# Altium schematic sheet front-end.SchDoc
size A2
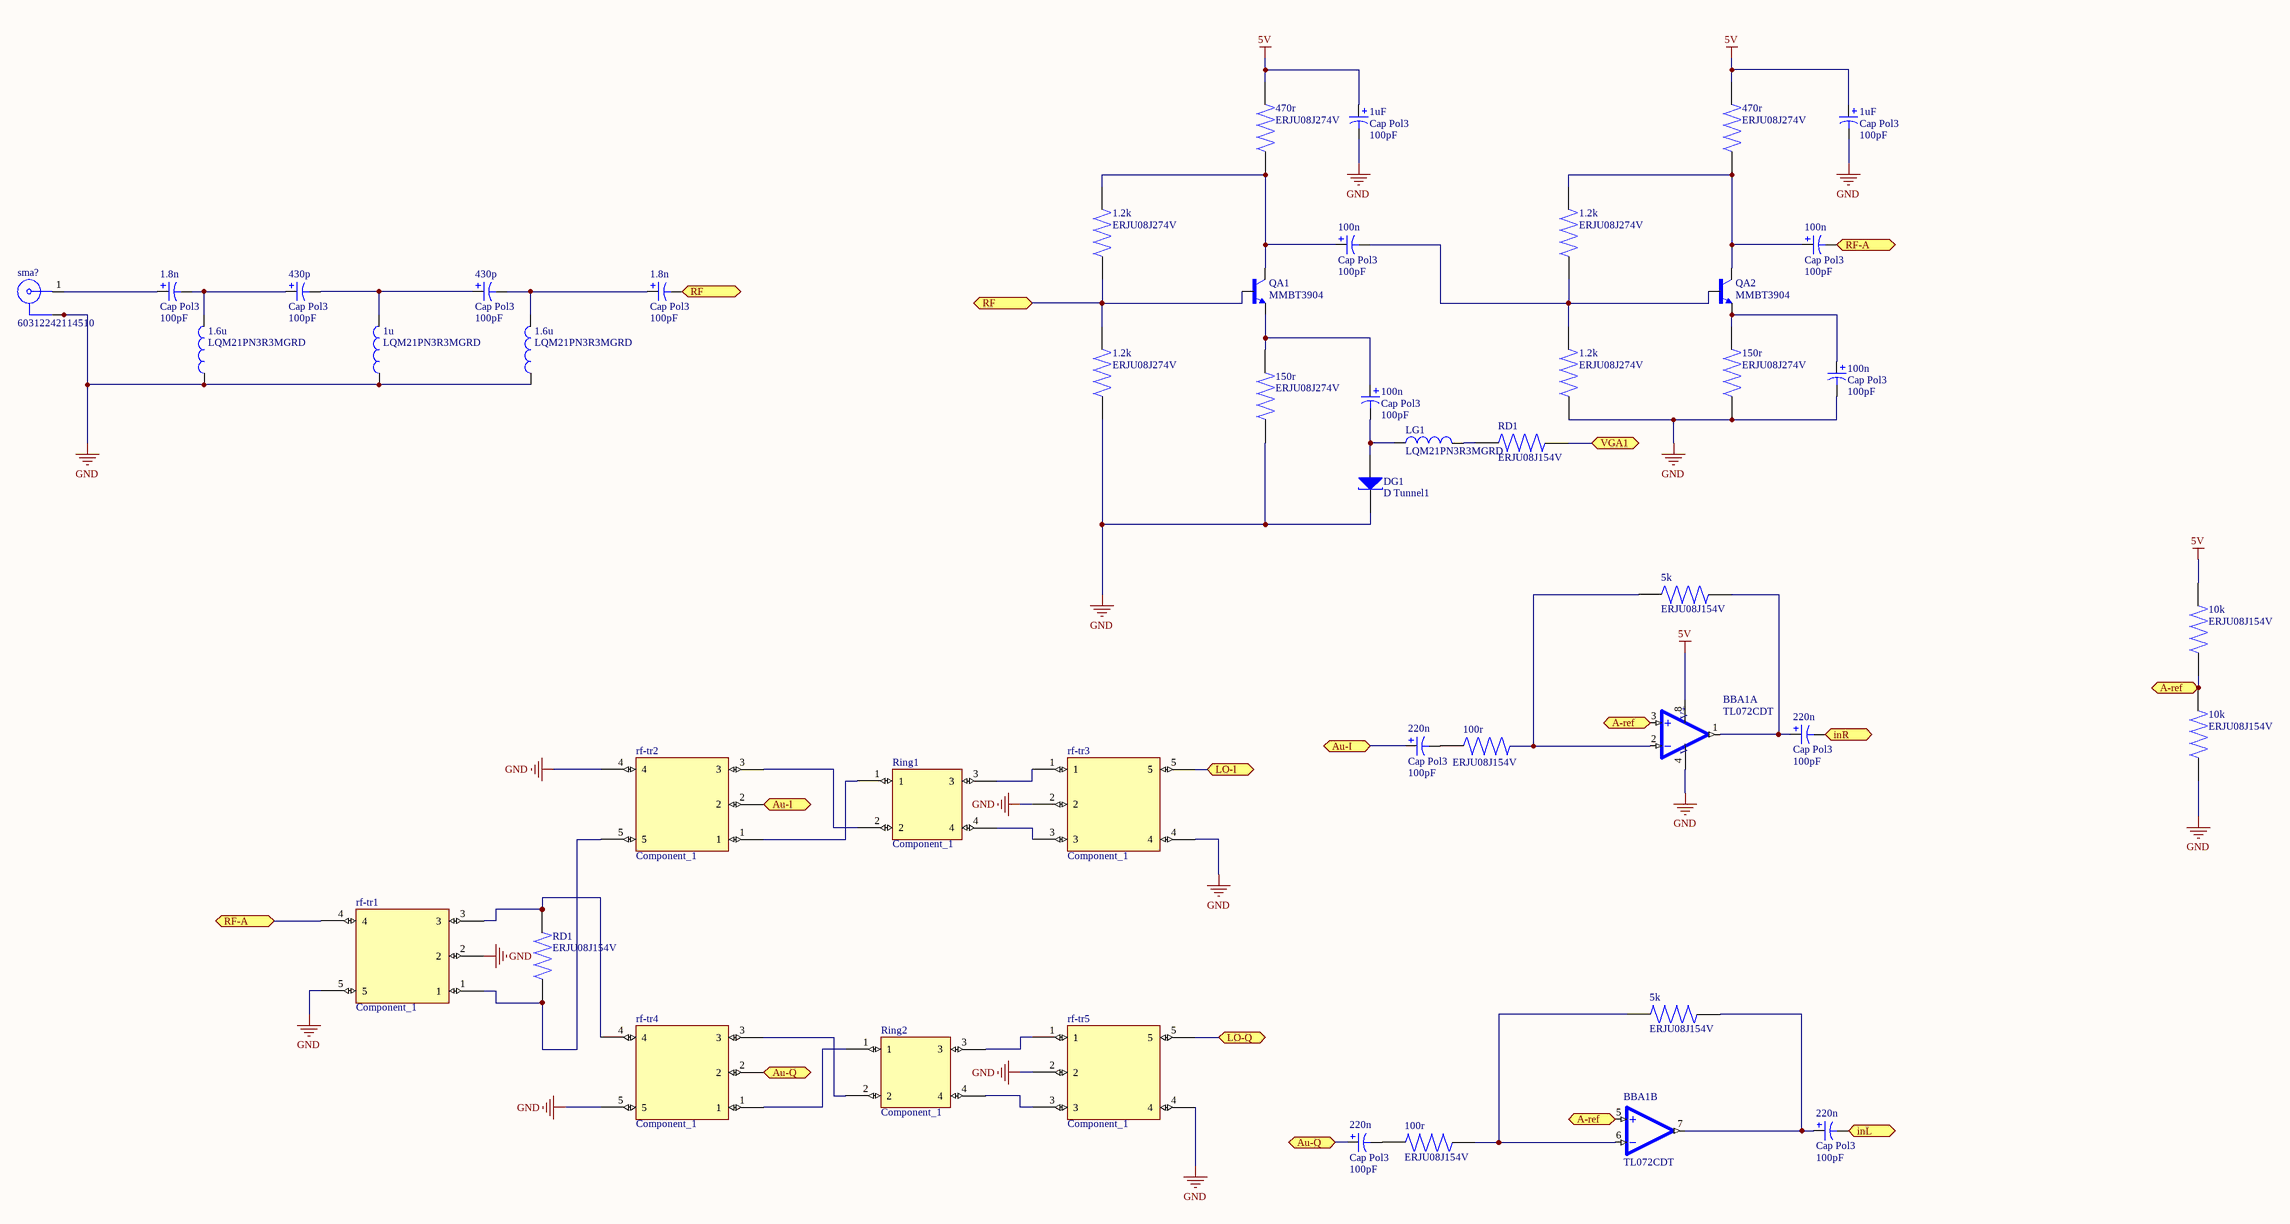
[diagram p0: front-end.SchDoc]

## Parts
(Parts that share a designator on the sheet are numbered #1, #2 ... from top to bottom, then left to right.)
1.2k#1  ERJU08J274V  [RES_ERJU08J274V]
1.2k#2  ERJU08J274V  [RES_ERJU08J274V]
1.2k#3  ERJU08J274V  [RES_ERJU08J274V]
1.2k#4  ERJU08J274V  [RES_ERJU08J274V]
1.6u#1  LQM21PN3R3MGRD  [INDC2012X100N]
1.6u#2  LQM21PN3R3MGRD  [INDC2012X100N]
1.8n#1  Cap Pol3  value 100pF  [C0805]
1.8n#2  Cap Pol3  value 100pF  [C0805]
1u  LQM21PN3R3MGRD  [INDC2012X100N]
1uF#1  Cap Pol3  value 100pF  [C0805]
1uF#2  Cap Pol3  value 100pF  [C0805]
5k#1  ERJU08J154V  [RES_ERJU08J154V]
5k#2  ERJU08J154V  [RES_ERJU08J154V]
10k#1  ERJU08J154V  [RES_ERJU08J154V]
10k#2  ERJU08J154V  [RES_ERJU08J154V]
100n#1  Cap Pol3  value 100pF  [C0805]
100n#2  Cap Pol3  value 100pF  [C0805]
100n#3  Cap Pol3  value 100pF  [C0805]
100n#4  Cap Pol3  value 100pF  [C0805]
100r#1  ERJU08J154V  [RES_ERJU08J154V]
100r#2  ERJU08J154V  [RES_ERJU08J154V]
150r#1  ERJU08J274V  [RES_ERJU08J274V]
150r#2  ERJU08J274V  [RES_ERJU08J274V]
220n#1  Cap Pol3  value 100pF  [C0805]
220n#2  Cap Pol3  value 100pF  [C0805]
220n#3  Cap Pol3  value 100pF  [C0805]
220n#4  Cap Pol3  value 100pF  [C0805]
430p#1  Cap Pol3  value 100pF  [C0805]
430p#2  Cap Pol3  value 100pF  [C0805]
470r#1  ERJU08J274V  [RES_ERJU08J274V]
470r#2  ERJU08J274V  [RES_ERJU08J274V]
BBA1  TL072CDT  [SOIC127P600X175-8N]  (parts A,B of 2)
DG1  D Tunnel1  [3.2X1.6X1.1]
LG1  LQM21PN3R3MGRD  [INDC2012X100N]
QA1  MMBT3904  [TRANS_MMBT3904]
QA2  MMBT3904  [TRANS_MMBT3904]
RD1#1  ERJU08J154V  [RES_ERJU08J154V]
RD1#2  ERJU08J154V  [RES_ERJU08J154V]
rf-tr1  Component_1  [RF-transformer]
rf-tr2  Component_1  [RF-transformer]
rf-tr3  Component_1  [RF-transformer]
rf-tr4  Component_1  [RF-transformer]
rf-tr5  Component_1  [RF-transformer]
Ring1  Component_1  [TRANS_BFP183E7764HTSA1]
Ring2  Component_1  [TRANS_BFP183E7764HTSA1]
sma?  60312242114510  [60312242114510]

## Ports
A-ref, Au-I, Au-Q, inL, inR, LO-I, LO-Q, RF, RF-A, VGA1

## Nets
5V: 1uF#1.1 1uF#2.1 10k#1.2 470r#1.2 470r#2.2 BBA1.8(V+)
GND: 1.2k#3.1 1.2k#4.1 1.6u#1.1 1.6u#2.1 1u.1 1uF#1.2 1uF#2.2 10k#2.1 100n#3.2 150r#1.1 150r#2.1 BBA1.4(V-) DG1.2(K) rf-tr1.2 rf-tr1.5 rf-tr2.4 rf-tr3.2 rf-tr3.4 rf-tr4.5 rf-tr5.2 rf-tr5.4 sma?.2 sma?.3 sma?.4 sma?.5
A-ref: 10k#1.1 10k#2.2 BBA1.3(+IN1) BBA1.5(+IN2) ; port A-ref
Au-I: 220n#2.1 rf-tr2.2 ; port Au-I
Au-Q: 220n#4.1 rf-tr4.2 ; port Au-Q
inL: 220n#3.2 ; port inL
inR: 220n#1.2 ; port inR
LO-I: rf-tr3.5 ; port LO-I
LO-Q: rf-tr5.5 ; port LO-Q
RF: 1.2k#1.1 1.2k#3.2 1.8n#2.2 QA1.1(B) ; port RF
RF-A: 100n#2.2 rf-tr1.4 ; port RF-A
VGA1: RD1#1.2 ; port VGA1
Net1.2k#1_2: 1.2k#1.2 100n#1.1 470r#1.1 QA1.3(C)
Net1.2k#2_1: 1.2k#2.1 1.2k#4.2 100n#1.2 QA2.1(B)
Net1.2k#2_2: 1.2k#2.2 100n#2.1 470r#2.1 QA2.3(C)
Net1.6u#1_2: 1.6u#1.2 1.8n#1.2 430p#1.1
Net1.6u#2_2: 1.6u#2.2 1.8n#2.1 430p#2.2
Net1.8n#1_1: 1.8n#1.1 sma?.1
Net1u_2: 1u.2 430p#1.2 430p#2.1
Net5k#1_1: 5k#1.1 100r#1.2 BBA1.2(-IN1)
Net5k#1_2: 5k#1.2 220n#1.1 BBA1.1(OUT1)
Net5k#2_1: 5k#2.1 220n#3.1 BBA1.7(OUT2)
Net5k#2_2: 5k#2.2 100r#2.1 BBA1.6(-IN2)
Net100n#3_1: 100n#3.1 150r#1.2 QA2.2(E)
Net100n#4_1: 100n#4.1 150r#2.2 QA1.2(E)
Net100n#4_2: 100n#4.2 DG1.1(A) LG1.1
Net100r#1_1: 100r#1.1 220n#2.2
Net100r#2_2: 100r#2.2 220n#4.2
NetLG1_2: LG1.2 RD1#1.1
NetRD1#2_1: RD1#2.1 rf-tr1.1 rf-tr2.5
NetRD1#2_2: RD1#2.2 rf-tr1.3 rf-tr4.4
Netrf-tr2_1: rf-tr2.1 Ring1.1
Netrf-tr2_3: rf-tr2.3 Ring1.2
Netrf-tr3_1: rf-tr3.1 Ring1.3
Netrf-tr3_3: rf-tr3.3 Ring1.4
Netrf-tr4_1: rf-tr4.1 Ring2.1
Netrf-tr4_3: rf-tr4.3 Ring2.2
Netrf-tr5_1: rf-tr5.1 Ring2.3
Netrf-tr5_3: rf-tr5.3 Ring2.4

## Library data of the parts
1.6u#1 1.6u#2 1u LG1 = LQM21PN3R3MGRD: 0805 Multillayer Type (Ferrite Core) for Power lines; Package: None; Price: None; Value: *; MP: LQM21PN3R3MGRD; Availability: Unavailable
1.8n#1 1.8n#2 1uF#1 1uF#2 100n#1-100n#4 220n#1-220n#4 430p#1 430p#2 = Cap Pol3: Polarized Capacitor (Surface Mount); Published: 8-Jun-2000; LatestRevisionDate: 29-May-2009; LatestRevisionNote: IPC-7351 Footprint Added.; PackageReference: C0805; Publisher: Altium Limited; PackageDescription: Chip Capacitor
5k#1 5k#2 10k#1 10k#2 100r#1 100r#2 RD1#1 RD1#2 = ERJU08J154V: 1206 anti-sulfurated resistor 1206 Anti-Sulfurated; MF: Panasonic; MP: ERJ-U08J154V; SnapEDA_Link: https://www.snapeda.com/parts/ERJ-U08J154V/Panasonic/view-part/?ref=snap; Package: 3216-2 Panasonic; Value: *; Check_prices: https://www.snapeda.com/parts/ERJ-U08J154V/Panasonic/view-part/?ref=eda
BBA1 = TL072CDT: Dual Low-Noise JFET-Input General-Purpose Operational Amplifier 8-SOIC 0 to 70; MF: STMicroelectronics; SnapEDA_Link: https://www.snapeda.com/parts/TL072CD/STMicroelectronics/view-part/?ref=snap; Package: SOIC-8 Texas Instruments; Value: *; MP: TL072CD; Check_prices: https://www.snapeda.com/parts/TL072CD/STMicroelectronics/view-part/?ref=eda
DG1 = D Tunnel1: Tunnel Diode - RLC Model; Published: 8-Jun-2000; LatestRevisionDate: 17-Jul-2002; LatestRevisionNote: Re-released for DXP Platform.; PackageVersion: Feb-2002; PackageReference: 3.2X1.6X1.1; Publisher: Altium Limited; PackageDescription: SM LED; 2 Flat Leads
QA1 QA2 = MMBT3904: BJT, SOT-23, 40V, 200mA, NPN, 0.35W, 150Â°C; MF: Diotec Semiconductor; SnapEDA_Link: https://www.snapeda.com/parts/MMBT3904/Diotec/view-part/?ref=snap; Package: SOT-23 Diotec; Value: *; MP: MMBT3904; Check_prices: https://www.snapeda.com/parts/MMBT3904/Diotec/view-part/?ref=eda
rf-tr1-rf-tr5 = Component_1: RF-transformer
sma? = 60312242114510: RF COAX CONN, SMA JACK, 50 OHM, PCB;; MF: Wurth Electronics; SnapEDA_Link: https://www.snapeda.com/parts/60312242114510/Wurth+Electronics+Inc/view-part/?ref=snap; Package: None; Value: *; MP: 60312242114510; Check_prices: https://www.snapeda.com/parts/60312242114510/Wurth+Electronics+Inc/view-part/?ref=eda
1.2k#1-1.2k#4 150r#1 150r#2 470r#1 470r#2 = ERJU08J274V: MP: ERJU08J274V; Availability: Unavailable; Package: None; Value: *; Price: None